# Altium schematic sheet main_base.SchDoc
size C
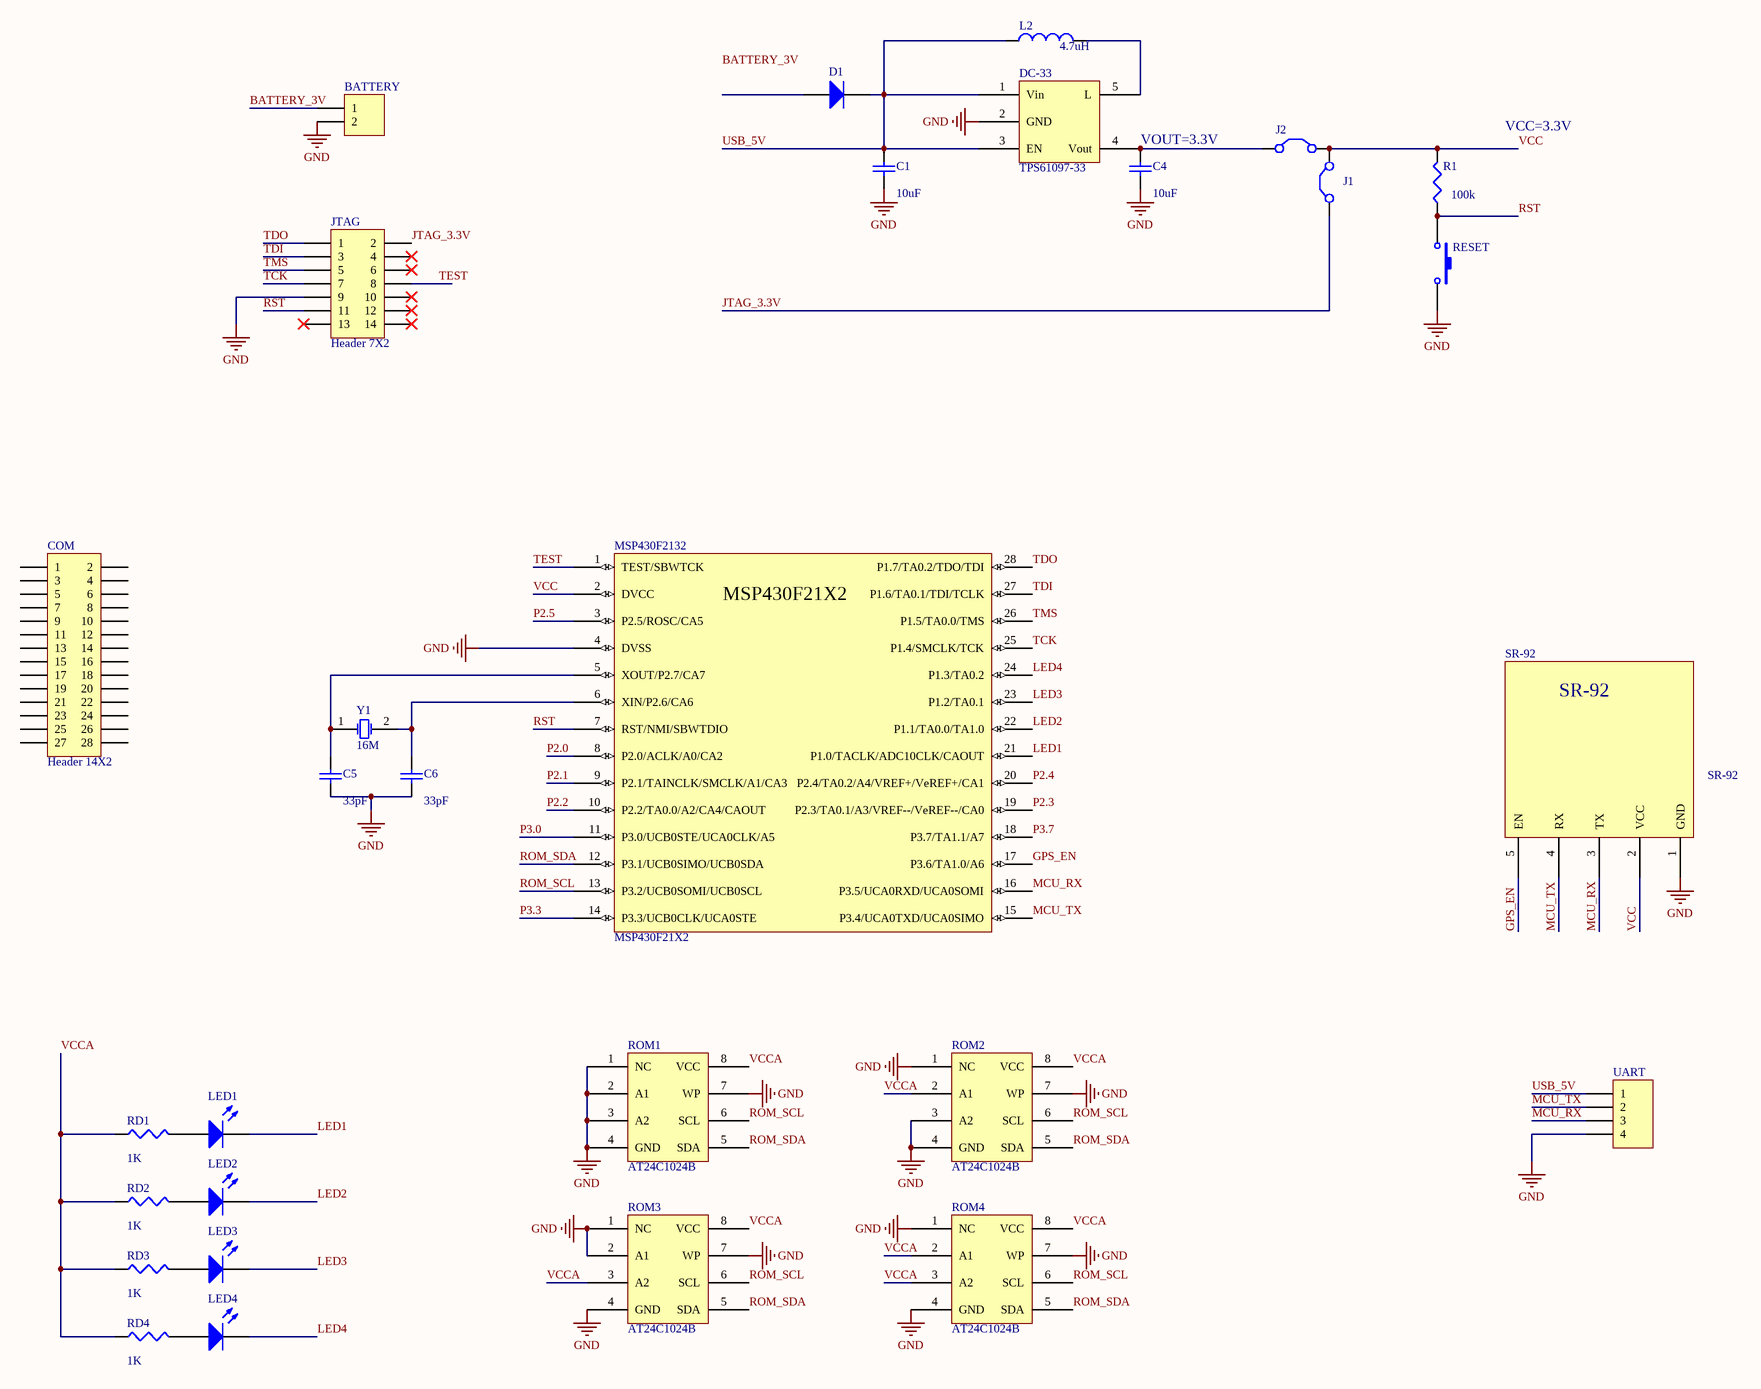
[diagram p0: main_base.SchDoc]

## Parts
BATTERY  (no value)  [HDR1X2H]
C1  value 10uF  [CAPC3216L]
C4  value 10uF  [CAPC3216L]
C5  value 33pF  [CAPC3216L]
C6  value 33pF  [CAPC3216L]
COM  Header 14X2  [HDR2X14]
D1  Switch Diode  [SOT95P240-3N]  (value not drawn)
DC-33  TPS61097-33  [DBV005]
J1  (no value)  [RAD-0.2]
J2  (no value)  [RAD-0.2]
JTAG  Header 7X2  [HDR2X7]
L2  value 4.7uH  [INDC4532L]
LED1  LED2  [DSO-F2/D6.1]  (value not drawn)
LED2  LED2  [DSO-F2/D6.1]  (value not drawn)
LED3  LED2  [DSO-F2/D6.1]  (value not drawn)
LED4  LED2  [DSO-F2/D6.1]  (value not drawn)
MSP430F2132  MSP430F21X2  [PW028]
R1  value 100k  [RESC1608L]
RD1  value 1K  [RESC1608L]
RD2  value 1K  [RESC1608L]
RD3  value 1K  [RESC1608L]
RD4  value 1K  [RESC1608L]
RESET  (no value)  [SPST-2]
ROM1  AT24C1024B  [8S2_M]
ROM2  AT24C1024B  [8S2_M]
ROM3  AT24C1024B  [8S2_M]
ROM4  AT24C1024B  [8S2_M]
SR-92  SR-92  [HDR1X5]
UART  (no value)  [HDR1X4H]
Y1  16M  [BCY-W2/D3.1]

## Nets
GND: BATTERY.2 C1.1 C4.1 C5.1 C6.1 DC-33.2(GND) JTAG.9 MSP430F2132.4(DVSS) RESET.2 ROM1.1(NC) ROM1.2(A1) ROM1.3(A2) ROM1.4(GND) ROM1.7(WP) ROM2.1(NC) ROM2.3(A2) ROM2.4(GND) ROM2.7(WP) ROM3.1(NC) ROM3.2(A1) ROM3.4(GND) ROM3.7(WP) ROM4.1(NC) ROM4.4(GND) ROM4.7(WP) SR-92.1(GND) UART.4
BATTERY_3V: BATTERY.1
GPS_EN: MSP430F2132.17(P3.6/TA1.0/A6) SR-92.5(EN)
JTAG_3.3V: J1.1(C1) JTAG.2
LED1: LED1.2(K) MSP430F2132.21(P1.0/TACLK/ADC10CLK/CAOUT)
LED2: LED2.2(K) MSP430F2132.22(P1.1/TA0.0/TA1.0)
LED3: LED3.2(K) MSP430F2132.23(P1.2/TA0.1)
LED4: LED4.2(K) MSP430F2132.24(P1.3/TA0.2)
MCU_RX: MSP430F2132.16(P3.5/UCA0RXD/UCA0SOMI) SR-92.3(TX) UART.3
MCU_TX: MSP430F2132.15(P3.4/UCA0TXD/UCA0SIMO) SR-92.4(RX) UART.2
P2.0: MSP430F2132.8(P2.0/ACLK/A0/CA2)
P2.1: MSP430F2132.9(P2.1/TAINCLK/SMCLK/A1/CA3)
P2.2: MSP430F2132.10(P2.2/TA0.0/A2/CA4/CAOUT)
P2.3: MSP430F2132.19(P2.3/TA0.1/A3/VREF--/VeREF--/CA0)
P2.4: MSP430F2132.20(P2.4/TA0.2/A4/VREF+/VeREF+/CA1)
P2.5: MSP430F2132.3(P2.5/ROSC/CA5)
P3.0: MSP430F2132.11(P3.0/UCB0STE/UCA0CLK/A5)
P3.3: MSP430F2132.14(P3.3/UCB0CLK/UCA0STE)
P3.7: MSP430F2132.18(P3.7/TA1.1/A7)
ROM_SCL: MSP430F2132.13(P3.2/UCB0SOMI/UCB0SCL) ROM1.6(SCL) ROM2.6(SCL) ROM3.6(SCL) ROM4.6(SCL)
ROM_SDA: MSP430F2132.12(P3.1/UCB0SIMO/UCB0SDA) ROM1.5(SDA) ROM2.5(SDA) ROM3.5(SDA) ROM4.5(SDA)
RST: JTAG.11 MSP430F2132.7(RST/NMI/SBWTDIO) R1.1 RESET.1
TCK: JTAG.7 MSP430F2132.25(P1.4/SMCLK/TCK)
TDI: JTAG.3 MSP430F2132.27(P1.6/TA0.1/TDI/TCLK)
TDO: JTAG.1 MSP430F2132.28(P1.7/TA0.2/TDO/TDI)
TEST: JTAG.8 MSP430F2132.1(TEST/SBWTCK)
TMS: JTAG.5 MSP430F2132.26(P1.5/TA0.0/TMS)
USB_5V: C1.2 D1.3(K) DC-33.1(Vin) DC-33.3(EN) L2.1 UART.1
VCC: J1.2(C2) J2.2(C2) MSP430F2132.2(DVCC) R1.2 SR-92.2(VCC)
VCCA: RD1.1 RD2.1 RD3.1 RD4.1 ROM1.8(VCC) ROM2.2(A1) ROM2.8(VCC) ROM3.3(A2) ROM3.8(VCC) ROM4.2(A1) ROM4.3(A2) ROM4.8(VCC)
NetC4_2: C4.2 DC-33.4(Vout) J2.1(C1)
NetC5_2: C5.2 MSP430F2132.5(XOUT/P2.7/CA7) Y1.1(OSC1)
NetC6_2: C6.2 MSP430F2132.6(XIN/P2.6/CA6) Y1.2(OSC2)
NetDC-33_5: DC-33.5(L) L2.2
NetLED1_1: LED1.1(A) RD1.2
NetLED2_1: LED2.1(A) RD2.2
NetLED3_1: LED3.1(A) RD3.2
NetLED4_1: LED4.1(A) RD4.2

Not connected (* = marked no-connect by the designer): COM 1 2 3 4 5 6 7 8 9 10 11 12 13 14 15 16 17 18 19 20 21 22 23 24 25 26 27 28; D1 1(A); JTAG 4* 6* 10* 12* 13* 14*

## Notes on the sheet
- (near C4) VOUT=3.3V
- VCC=3.3V
- Labels drawn without touching a wire or pin: BATTERY_3V

## Library data of the parts
BATTERY = Header 2H: Header, 2-Pin, Right Angle; LatestRevisionDate: 17-Jul-2002; LatestRevisionNote: Re-released for DXP Platform.; Publisher: Altium Limited
C1 C4-C6 = Cap Semi: Capacitor (Semiconductor SIM Model); Published: 8-Jun-2000; LatestRevisionDate: 29-May-2009; LatestRevisionNote: IPC-7351 Footprint Added.; PackageReference: C1206; Publisher: Altium Limited; PackageDescription: Chip Capacitor
COM = Header 14X2: Header, 14-Pin, Dual row; LatestRevisionDate: 17-Jul-2002; LatestRevisionNote: Re-released for DXP Platform.; Publisher: Altium Limited
D1 = Diode BAS116: Silicon Low Leakage Diode; Note: Pin 2 is not connected and not drawn.; Published: 21-Mar-2003; LatestRevisionDate: 29-May-2009; LatestRevisionNote: IPC-7351 Footprint Added.; DatasheetVersion: Oct-1999; PackageVersion: Sep-2001; PackageReference: SOT-23; Publisher: Altium Limited; PackageDescription: 3-Pin SOT-23 Package 0.95 mm Pitch, 2.5 mm Lead Span; ComponentLink1Description: Manufacturer Link; ComponentLink1URL: http://www.infineon.com/; ComponentLink2Description: Datasheet; ComponentLink2URL: http://www.infineon.com/upload/Document/cmc_upload/documents/080/656/bas116series.pdf
J1 J2 = Jumper: Jumper Wire; Published: 24-Mar-1999; LatestRevisionDate: 17-Jul-2002; LatestRevisionNote: Re-released for DXP Platform.; PackageReference: RAD-0.2; Publisher: Altium Limited
JTAG = Header 7X2: Header, 7-Pin, Dual row; LatestRevisionDate: 17-Jul-2002; LatestRevisionNote: Re-released for DXP Platform.; Publisher: Altium Limited
L2 = Inductor: Code_IEC: 1005; Published: 8-Jun-2000; LatestRevisionDate: 29-May-2009; LatestRevisionNote: IPC-7351 Footprint Added.; PackageReference: 0402-A; Publisher: Altium Limited; PackageDescription: Chip Inductor; Code_JEITA: 0402
LED1-LED4 = LED2: Typical RED, GREEN, YELLOW, AMBER GaAs LED; Published: 8-Jun-2000; LatestRevisionDate: 17-Jul-2002; LatestRevisionNote: Re-released for DXP Platform.; PackageVersion: Feb-2002; PackageReference: 3.2X1.6X1.1; Publisher: Altium Limited
R1 RD1-RD4 = Res3: Resistor; Published: 8-Jun-2000; LatestRevisionDate: 29-May-2009; LatestRevisionNote: IPC-7351 Footprint Added.; PackageReference: J1-0603; Publisher: Altium Limited; PackageDescription: Chip Resistor
RESET = SW-PB: Switch; Published: 24-Mar-1999; LatestRevisionDate: 17-Jul-2002; LatestRevisionNote: Re-released for DXP Platform.; PackageReference: SPST-2; Publisher: Altium Limited
UART = Header 4H: Header, 4-Pin, Right Angle; LatestRevisionDate: 17-Jul-2002; LatestRevisionNote: Re-released for DXP Platform.; Publisher: Altium Limited
Y1 = XTAL: Crystal Oscillator; Published: 8-Jun-2000; LatestRevisionDate: 17-Jul-2002; LatestRevisionNote: Re-released for DXP Platform.; PackageReference: R38; Publisher: Altium Limited